# Altium schematic sheet USB_UART_Converter.SchDoc
size A; SheetNumber: 6; SheetTotal: 7
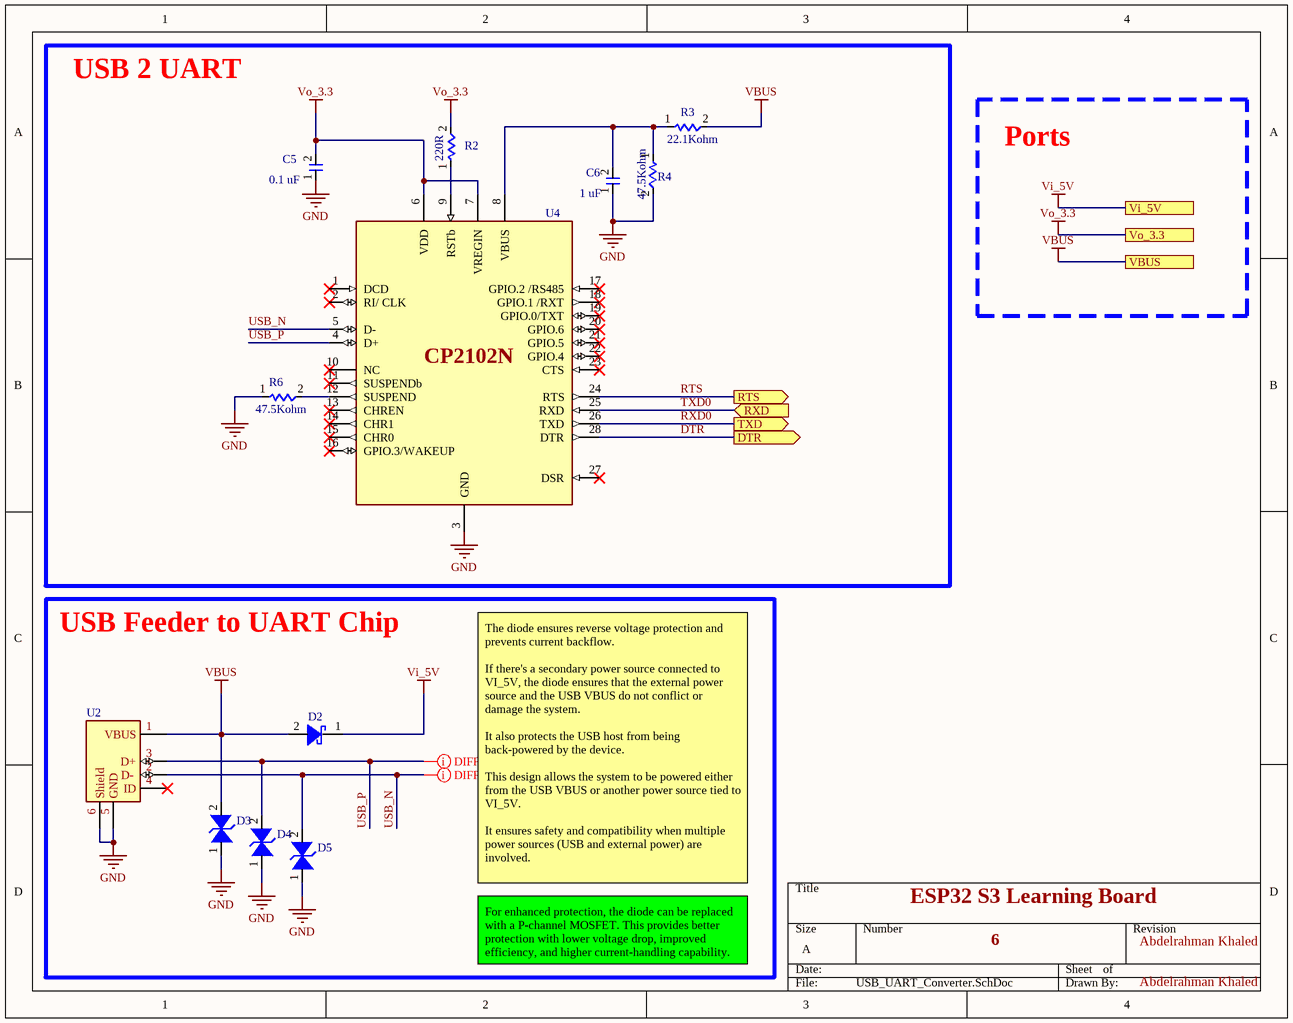
[diagram p0: USB_UART_Converter.SchDoc]

## Parts
C5  0.1 uF  [Capacitor]
C6  1 uF  [Capacitor]
D2  0.2V Drop Volt  [Schoktty Diode]  (value not drawn)
D3  TVS Diode  [TVS Diode]  (value not drawn)
D4  TVS Diode  [TVS Diode]  (value not drawn)
D5  TVS Diode  [TVS Diode]  (value not drawn)
R2  220R  [Resistor]
R3  22.1Kohm  [Resistor]
R4  47.5Kohm  [Resistor]
R6  47.5Kohm  [Resistor]
U2  USB_B Micro  [USB8_Micro]  (value not drawn)
U4  CP2102N  [CP2102N]  (value not drawn)

## Blocks framed on the sheet
USB 2 UART: C5 C6 R2-R4 R6 U4
USB Feeder to UART Chip: D2-D5 U2

## Ports
DTR (out, see Block Diagram[1B], Microcontroller's_Prephirals_Sheet[4A]), RTS (out, see Block Diagram[1B], Microcontroller's_Prephirals_Sheet[4B]), RXD (in, see Block Diagram[1B], Microcontroller_ESP32_S3[4D]), TXD (out, see Block Diagram[1B], Microcontroller_ESP32_S3[4C]), VBUS (see Block Diagram[1B], USB_Communication_Sheet[4B]), Vi_5V (see Block Diagram[1B], LDO_Sheet[4B], Microcontroller_ESP32_S3[4D], RGB_Logical_Shifter_Sheet[4A], USB_Communication_Sheet[4B]), Vo_3.3 (see Block Diagram[1B], LDO_Sheet[4B], Microcontroller's_Prephirals_Sheet[4A], RGB_Logical_Shifter_Sheet[4A])

## Nets
GND: C5.1(Pin_1) C6.1(Pin_1) D3.1 D4.1 D5.1 R4.2(pin_2) R6.1(Pin_1) U2.5(GND) U2.6(Shield) U4.3(GND)
VBUS: D2.2 D3.2 R3.2(pin_2) U2.1(VBUS) ; port VBUS
Vi_5V: D2.1 ; port Vi_5V
Vo_3.3: C5.2(Pin_2) R2.2(pin_2) U4.6(VDD) U4.7(VREGIN) ; port Vo_3.3
DTR: U4.28(DTR) ; port DTR
RTS: U4.24(RTS) ; port RTS
RXD0: U4.26(TXD) ; port TXD
TXD0: U4.25(RXD) ; port RXD
USB_N: D5.2 U2.2(D-) U4.5(D-)
USB_P: D4.2 U2.3(D+) U4.4(D+)
NetC6_2: C6.2(Pin_2) R3.1(Pin_1) R4.1(Pin_1) U4.8(VBUS)
NetR2_1: R2.1(Pin_1) U4.9(RSTb)
NetR6_2: R6.2(pin_2) U4.12(SUSPEND)

Not connected (* = marked no-connect by the designer): U2 4(ID)*; U4 1(DCD)* 2(RI/_CLK)* 10(NC)* 11(SUSPENDb)* 13(CHREN)* 14(CHR1)* 15(CHR0)* 16(GPIO.3/WAKEUP)* 17(GPIO.2_/RS485)* 18(GPIO.1_/RXT)* 19(GPIO.0/TXT)* 20(_GPIO.6)* 21(_GPIO.5)* 22(_GPIO.4)* 23(CTS)* 27(DSR)*

## Layout directives
differential pair; differential pair class Diff_90_ohm: USB_N, USB_P

## Notes on the sheet
- Ports
- The diode ensures reverse voltage protection and prevents current backflow.
  If there's a secondary power source connected to VI_5V, the diode ensures that the external power source and the USB VBUS do not conflict or damage the system.
  It also protects the USB host from being back-powered by the device.
  This design allows the system to be powered either from the USB VBUS or another power source tied to VI_5V.
  It ensures safety and compatibility when multiple power sources (USB and external power) are involved.
- ESP32 S3 Learning Board
- For enhanced protection, the diode can be replaced with a P-channel MOSFET. This provides better protection with lower voltage drop, improved efficiency, and higher current-handling capability.
- 6
- Abdelrahman Khaled

## Library data of the parts
C5 C6 = Capacitor
D2 = Schottky Diode: NRVB120ESFT1G; ComponentLink1Description: Link; ComponentLink1URL: https://www.digikey.com/en/products/detail/onsemi/NSR20F40NXT5G/5801655
R2-R4 R6 = Resistance